# Altium schematic sheet ADC.SchDoc: ADC
size A4; DocumentNumber: 3; Revision: 2.0; SheetNumber: 3; SheetTotal: 18
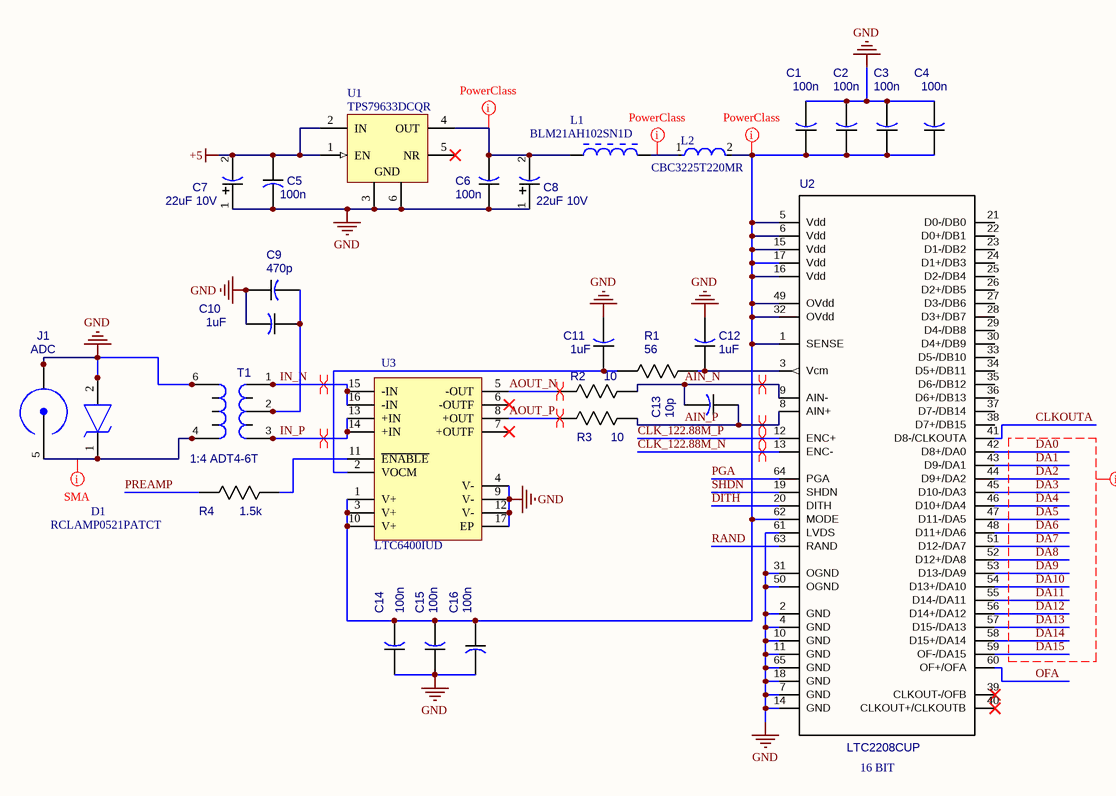
[diagram p0: ADC.SchDoc]

## Parts
C1  100n  [CAP_0805]
C2  100n  [CAP_0805]
C3  100n  [CAP_0805]
C4  100n  [CAP_0805]
C5  100n  [CAP_0805]
C6  100n  [CAP_0805]
C7  22uF 10V  [CAPAE_4.3x4.3h5.4]
C8  22uF 10V  [CAPAE_4.3x4.3h5.4]
C9  470p  [CAP_0805]
C10  1uF  [CAP_0805]
C11  1uF  [CAP_0805]
C12  1uF  [CAP_0805]
C13  10p  [CAP_0805]
C14  100n  [CAP_0805]
C15  100n  [CAP_0805]
C16  100n  [CAP_0805]
D1  RCLAMP0521PATCT  [RCLAMP0521PATCT]
J1  ADC  [31-5431]
L1  BLM21AH102SN1D  [INDC2013X105X50NL20T20]
L2  CBC3225T220MR  [FP-CB3225-IPC_B]
R1  56  [RES_0805]
R2  10  [RES_0603]
R3  10  [RES_0603]
R4  1.5k  [RES_0805]
T1  1:4 ADT4-6T  [TRANSF_ACORE2]
U1  TPS79633DCQR  [DCQ0006A_L]
U2  LTC2208CUP  [LTC2208CUP]
U3  LTC6400IUD  [LT-UD-16_N]

## Nets
+5: C5.1 C7.2(MINUS) U1.1(EN) U1.2(IN)
GND: C1.2 C2.2 C3.2 C4.2 C5.2 C6.1 C7.1(PLUS) C8.1(PLUS) C9.1 C10.2 C11.2 C12.2 C14.1 C15.1 C16.2 D1.2(A) J1.1(GND) J1.2(GND) J1.3(GND) J1.4(GND) T1.6(P2) T1.10 U1.3(GND) U1.6(GND) U2.2(GND) U2.4(GND) U2.7(GND) U2.10(GND) U2.11(GND) U2.14(GND) U2.18(GND) U2.31(OGND) U2.50(OGND) U2.61(LVDS) U2.65(GND) U3.4(V-) U3.9(V-) U3.12(V-) U3.17(EP)
AIN_N: C13.2 R2.2 U2.9(AIN-)
AIN_P: C13.1 R3.2 U2.8(AIN+)
AOUT_N: R2.1 U3.5(-OUT)
AOUT_P: R3.1 U3.8(+OUT)
CLK_122.88M_N: U2.13(ENC-)
CLK_122.88M_P: U2.12(ENC+)
CLKOUTA: U2.41(D8-/CLKOUTA)
DA0: U2.42(D8+/DA0)
DA1: U2.43(D9-/DA1)
DA2: U2.44(D9+/DA2)
DA3: U2.45(D10-/DA3)
DA4: U2.46(D10+/DA4)
DA5: U2.47(D11-/DA5)
DA6: U2.48(D11+/DA6)
DA7: U2.51(D12-/DA7)
DA8: U2.52(D12+/DA8)
DA9: U2.53(D13-/DA9)
DA10: U2.54(D13+/DA10)
DA11: U2.55(D14-/DA11)
DA12: U2.56(D14+/DA12)
DA13: U2.57(D15-/DA13)
DA14: U2.58(D15+/DA14)
DA15: U2.59(OF-/DA15)
DITH: U2.20(DITH)
IN_N: T1.1(S3) T1.7 U3.15(-IN) U3.16(-IN)
IN_P: T1.3(S1) T1.9 U3.13(+IN) U3.14(+IN)
OFA: U2.60(OF+/OFA)
PGA: U2.64(PGA)
PREAMP: R4.2
RAND: U2.63(RAND)
SHDN: U2.19(SHDN)
NetC1_1: C1.1 C2.1 C3.1 C4.1 C14.2 C15.2 C16.1 L2.2 U2.1(SENSE) U2.5(Vdd) U2.6(Vdd) U2.15(Vdd) U2.16(Vdd) U2.17(Vdd) U2.32(OVdd) U2.49(OVdd) U2.62(MODE) U3.1(V+) U3.3(V+) U3.10(V+)
NetC6_2: C6.2 C8.2(MINUS) L1.1 U1.4(OUT)
NetC9_2: C9.2 C10.1 T1.2(S2) T1.8
NetC11_1: C11.1 R1.1 U3.2(VOCM)
NetC12_1: C12.1 R1.2 U2.3(Vcm)
NetD1_1: D1.1(K) J1.5(CON) T1.4(P1) T1.11
NetL1_2: L1.2 L2.1
NetR4_1: R4.1 U3.11(~{ENABLE})

Not connected (* = marked no-connect by the designer): U1 5(NR)*; U2 21(D0-/DB0) 22(D0+/DB1) 23(D1-/DB2) 24(D1+/DB3) 25(D2-/DB4) 26(D2+/DB5) 27(D3-/DB6) 28(D3+/DB7) 29(D4-/DB8) 30(D4+/DB9) 33(D5-/DB10) 34(D5+/DB11) 35(D6-/DB12) 36(D6+/DB13) 37(D7-/DB14) 38(D7+/DB15) 39(CLKOUT-/OFB)* 40(CLKOUT+/CLKOUTB)*; U3 6(-OUTF)* 7(+OUTF)*

## Layout directives
rule Width Constraint [Pref Impedance = 50.00ohms    Min Impedance = 50.00ohms    Max Impedance = 50.00ohms]: NetD1_1
differential pair: AIN_N, AIN_P, AOUT_N, AOUT_P, CLK_122.88M_N, CLK_122.88M_P, IN_N, IN_P
net class PowerPads: NetC1_1, NetC6_2, NetL1_2
net class ADC_DATA: DA0, DA1, DA2, DA3, DA4, DA5, DA6, DA7, DA8, DA9, DA10, DA11, DA12, DA13, DA14, DA15

## Notes on the sheet
- 16 BIT
- Title
- Size:
- Date:
- A4
- Number:
- Time:
- Revision:
- Sheet
- of
- File:

## Library data of the parts
C1-C6 C9-C16 = CAP_0805
  C1-C6 C14-C16: Value: 100n
  C9: Value: 470p
  C10-C12: Value: 1uF
  C13: Value: 10p
C7 C8 = CAPAE_4.3x4.3h5.4: Value: *
D1 = RCLAMP0521PATCT: TVS Diode (Uni-directional); Manufacturer_Name: SEMTECH; Datasheet Link: https://datasheet.datasheetarchive.com/originals/distributors/Datasheets-DGA26/1841510.pdf; Manufacturer_Part_Number: RCLAMP0521PATCT; Mouser Part Number: 947-RCLAMP0521PATCT; Mouser Price/Stock: https://www.mouser.co.uk/ProductDetail/Semtech/RCLAMP0521PATCT?qs=rBWM4%252BvDhIfB36%252BFxGdBkA%3D%3D; Arrow Part Number: RCLAMP0521PATCT; Arrow Price/Stock: https://www.arrow.com/en/products/rclamp0521patct/semtech?region=nac
J1 = 31-5431: SMA; Value: ADC
L1 = CMP-2000-05954-1: Chip Bead, 1000 Ohm, +/- 25%, 200 mA, -55 to 85 degC, 2-Pin SMD, RoHS, Tape and Reel; Manufacturer: Murata; Brand: MurataElectronics; Test Frequency: 100MHz; Maximum DC Resistance: 450mOhms; Case Length: 2mm; Maximum DC Current: 200mA; Case Height: 0.85mm; Case Width: 1.25mm; Impedance: 1kOhms; Datasheet URL: http://datasheet.octopart.com/BLM21AH102SN1D-Murata-datasheet-629859.pdf; Datasheet Version: 11/2017; Dimensions: 1.25mmWx2mmLx0.85mmH; Manufacturer URL: http://www.murata.com/; Packaging: Reel; Product: FerriteChipBeads; Product Category: EMIFilterBeads,Chips&Arrays; Operating Temperature Range: -55Cto+125C; Package / Case: 0805(2012metric); Series: BLM21A; Mounting Technology: SurfaceMount; Termination Style: SMD/SMT; Tolerance: 25%; RoHS: Details; Package Reference: 0805; Factory Pack Quantity: 4000; Package Description: 2-Pin Surface Mount Device, Body 2 x1.25 mm
L2 = CMP-14484-000363-1: SMD Inductors 22uH ±20% 0.78A 0.351Ω 1210; Test Frequency: 100kHz; DC Current: 780mA; Core Material: Ferrite; Self Resonant Frequency: 17MHz; DC Resistance (DCR): 351mR; Saturation Current: 620mA; Shielding: Unshielded; Height: 2.5mm; Tolerance: 20%; Max Operating Temperature: 105°C; Inductance: 22uH; Series: CB; Width: 0.098inch; Military Standard: Not; RoHS Compliant: Yes; Depth: 2.7mm; Max DC Current: 780mA; Package Quantity: 1000; Lead Free: Lead Free; Number of Pins: 2; Min Operating Temperature: -40°C; Current Rating: 780mA; Halogen Free: Halogen Free; Radiation Hardening: No; Case Code (Metric): 3225; Inductance Tolerance: 20%; Case Code (Imperial): 1210; Termination: SMD/SMT; Resistor Type: Wirewound; Mount: Surface Mount; Case/Package: 1210; Length: 0.126inch; Height - Seated (Max): 0.106inch; Packaging: Tape and Reel
R1 R4 = RES_0805
  R1: Value: 56
  R4: Value: 1.5k
R2 R3 = RES_0603: Value: 10
T1 = TRANSF_ACORE2: Transformer; Value: 1:4 ADT4-6T
U1 = CMP-0395-00327-2: Single Output High PSRR LDO, 1 A, Fixed 3.3 V Output, 2.7 to 5.5 V Input, 6-pin SOT-223 (DCQ), -40 to 125 degC, Green (RoHS & no Sb/Br); Manufacturer: Texas Instruments; Accuracy(%): 2; Iout(Max)(A): 1; Vdo(Typ)(mV): 220; SubFamily: Single Channel LDO; Vout Adj(Min)(V): 3.3; Vin(Max)(V): 5.5; Iq(Typ)(mA): 0.26; Vin(Min)(V): 2.7; DatasheetVersion: SLVS351N; ComponentLink2Description: Datasheet; PartNumber: TPS79633DCQR; PackageDescription: 6-Pin Plastic Small Outline, Body 3.5 x 6.5 mm, Pitch 1.27 mm; ComponentLink1Description: Manufacturer URL; ComponentLink2URL: http://www.ti.com/general/docs/lit/getliterature.tsp?genericPartNumber=TPS79633&fileType=pdf; ComponentLink3URL: http://www.ti.com/litv/pdf/mpds098c; Mounting Technology: Surface Mount; Fixed Output Options(V): 3.3; PackageReference: DCQ0006A; ComponentLink1URL: http://www.ti.com/; PackageVersion: 4202109/D; ComponentLink3Description: Package Specification; Vout Adj(Max)(V): 3.3; Eco-Plan: Green (RoHS & no Sb/Br)
U3 = CMP-0359-03855-2: Single Channel, Low Noise, Low Distortion Differential ADC Driver for 300 MHz IF, 1800 MHz Typical GBW, 4500 V/us Typical SR, 2.85 to 3.5 V, 16-Pin QFN (UD-16), Industrial, Pb-Free; Manufacturer: Linear Technology; Linear Technology Part Number: LTC6400-20; PartNumber: LTC6400IUD-20#PBF; Vs Min (V): 2.85; SR (V/us) Typical: 4500; Is (mA) Typical: 90; Vs Max (V): 3.5; Vos (mV) Typical: 2; GBW (MHz) Typical: 1800; Channels (#): 1; RoHS: Pb-Free; PackageReference: LT-UD-16; Type: DIFF; ComponentLink3Description: Package Specification; PackageDescription: 16-Lead Plastic QFN, Body 3.00 x 3.00 mm, Pitch 0.5 mm; ComponentLink1URL: http://www.linear.com/; Mounting Technology: Surface Mount; ComponentLink2URL: http://cds.linear.com/docs/en/datasheet/640020f.pdf; Code_JEDEC: MO-220; ComponentLink3URL: http://cds.linear.com/docs/en/packaging/QFN_16_05-08-1691.pdf; ComponentLink2Description: Datasheet; ComponentLink1Description: Manufacturer URL; RevisionNote: URLs updated
U2 = LTC2208CUP: Value: LTC2208CUP